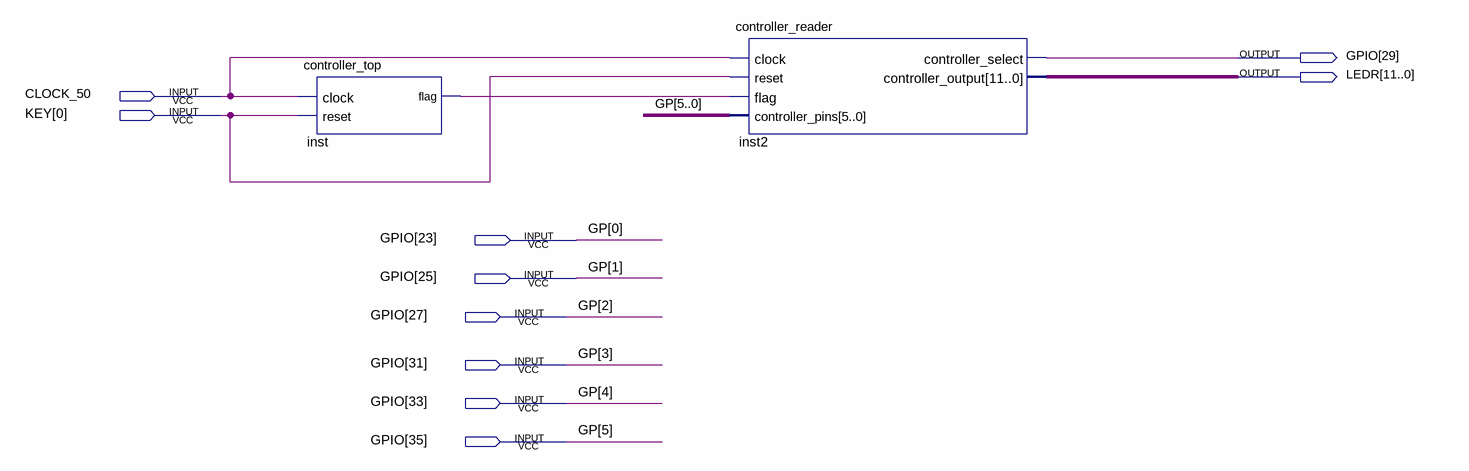
[diagram p0: schematic sheet]
// Quartus schematic teste-sudoku.bdf as structural Verilog: 2 symbols, 10 pins
module \teste-sudoku  (
  input  CLOCK_50,
  input  [0:0] KEY,
  inout  [35:23] GPIO,
  output [11:0] LEDR
);

  wire inst_flag;

  controller_top inst (.clock(CLOCK_50), .reset(KEY[0]), .flag(inst_flag));
  controller_reader inst2 (
    .clock(CLOCK_50), .reset(KEY[0]), .flag(inst_flag),
    .controller_pins({GPIO[35], GPIO[33], GPIO[31], GPIO[27], GPIO[25], GPIO[23]}),
    .controller_select(GPIO[29]), .controller_output(LEDR));

  // Other names for the same wires on the sheet: GP[5:0] = {GPIO[35], GPIO[33], GPIO[31], GPIO[27], GPIO[25], GPIO[23]}
endmodule
